# EAGLE design xmas-tree (EAGLE 6.5.0)
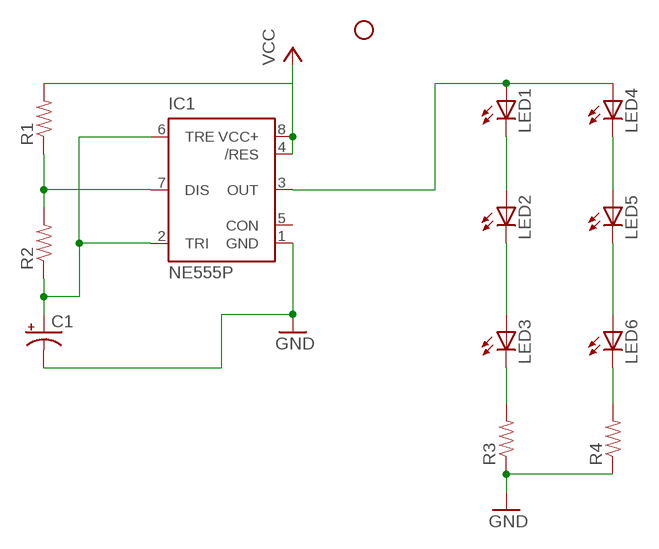
[diagram p0: schematic, sheet 1]

## Parts
C1  CAP_POLPTH2  [CPOL-RADIAL-10UF-25V]
IC1  NE555P  [DIL-08]
LED1  LED5MM  [LED5MM]
LED2  LED5MM  [LED5MM]
LED3  LED5MM  [LED5MM]
LED4  LED5MM  [LED5MM]
LED5  LED5MM  [LED5MM]
LED6  LED5MM  [LED5MM]
R1  RESISTORAXIAL-0.3  [AXIAL-0.3]
R2  RESISTORAXIAL-0.3  [AXIAL-0.3]
R3  RESISTORAXIAL-0.3  [AXIAL-0.3]
R4  RESISTORAXIAL-0.3  [AXIAL-0.3]
STANDOFF1  STAND-OFF  [STAND-OFF]

## Nets
GND: C1.2(-) IC1.1(GND) R3.P$1 R4.P$1
N$1: C1.1(+) IC1.2(TRI) IC1.6(TRE) R2.P$1
N$2: IC1.3(OUT) LED1.A LED4.A
N$3: LED1.K(C) LED2.A
N$4: LED2.K(C) LED3.A
N$5: LED3.K(C) R3.P$2
N$6: LED4.K(C) LED5.A
N$7: LED5.K(C) LED6.A
N$8: LED6.K(C) R4.P$2
N$9: IC1.7(DIS) R1.P$1 R2.P$2
VCC: IC1.4(/RES) IC1.8(VCC+) R1.P$2
Unconnected: IC1.5(CON)

## Library data of the parts
C1 = SparkFun-Passives:CAP_POL: Capacitor Polarized These are standard SMD and PTH capacitors. Normally 10uF, 47uF, and 100uF in electrolytic and tantalum varieties. Always verify the external diameter of the through hole cap, it varies with capacity, voltage, and manufacturer. The EIA devices should be standard.
IC1 = SparkFun-AnalogIC:NE555: General purpose bipolar Timer; MF: Arrow Electronics; MPN: NE555N; OC_FARNELL: 1467742; OC_NEWARK: 89K1486
LED1-LED6 = SparkFun-LED:LED: LEDs Standard schematic elements and footprints for 5mm, 3mm, 1206, and 0603 sized LEDs. 5mm - Spark Fun Electronics SKU : COM-00529 (and others)
R1-R4 = SparkFun-Passives:RESISTOR: Resistor Basic schematic elements and footprints for 0603, 1206, and PTH resistors.
STANDOFF1 = SparkFun-Electromechanical:STAND-OFF: #4 Stand Off This is the mechanical footprint for a #4 phillips button head screw. Use the keepout ring to avoid running the screw head into surrounding components. SKU : PRT-00447

## Board
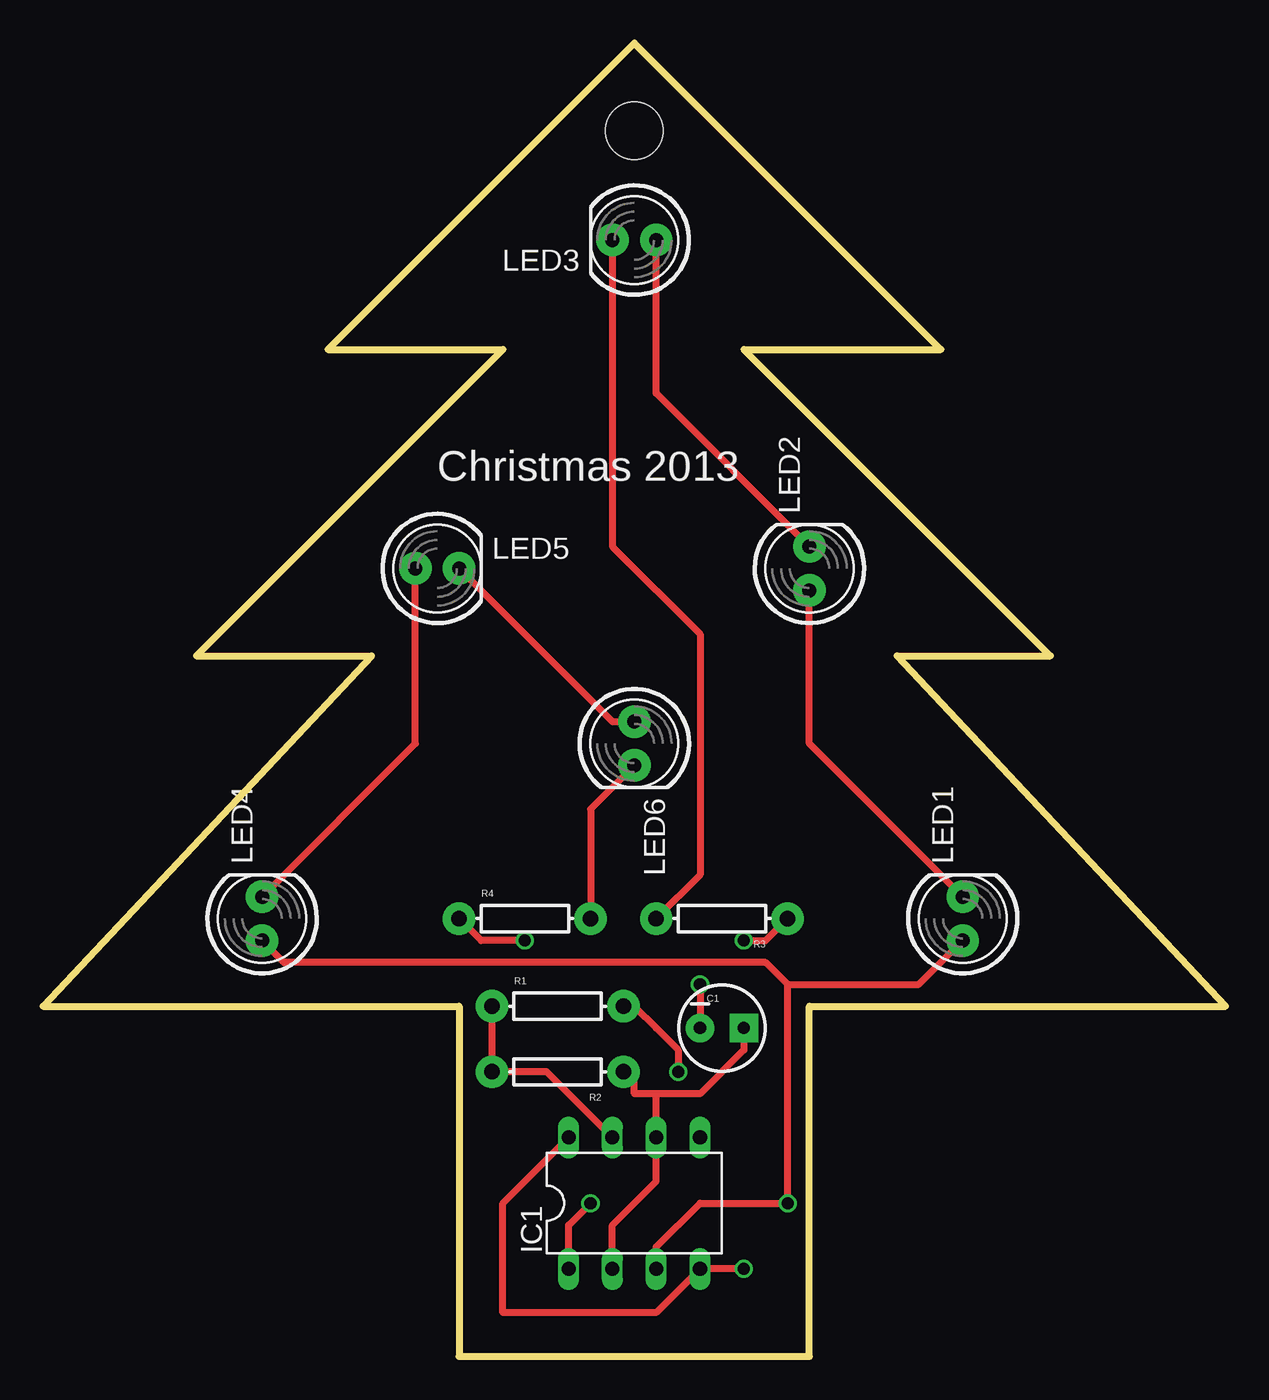
[diagram p1: board, top side]
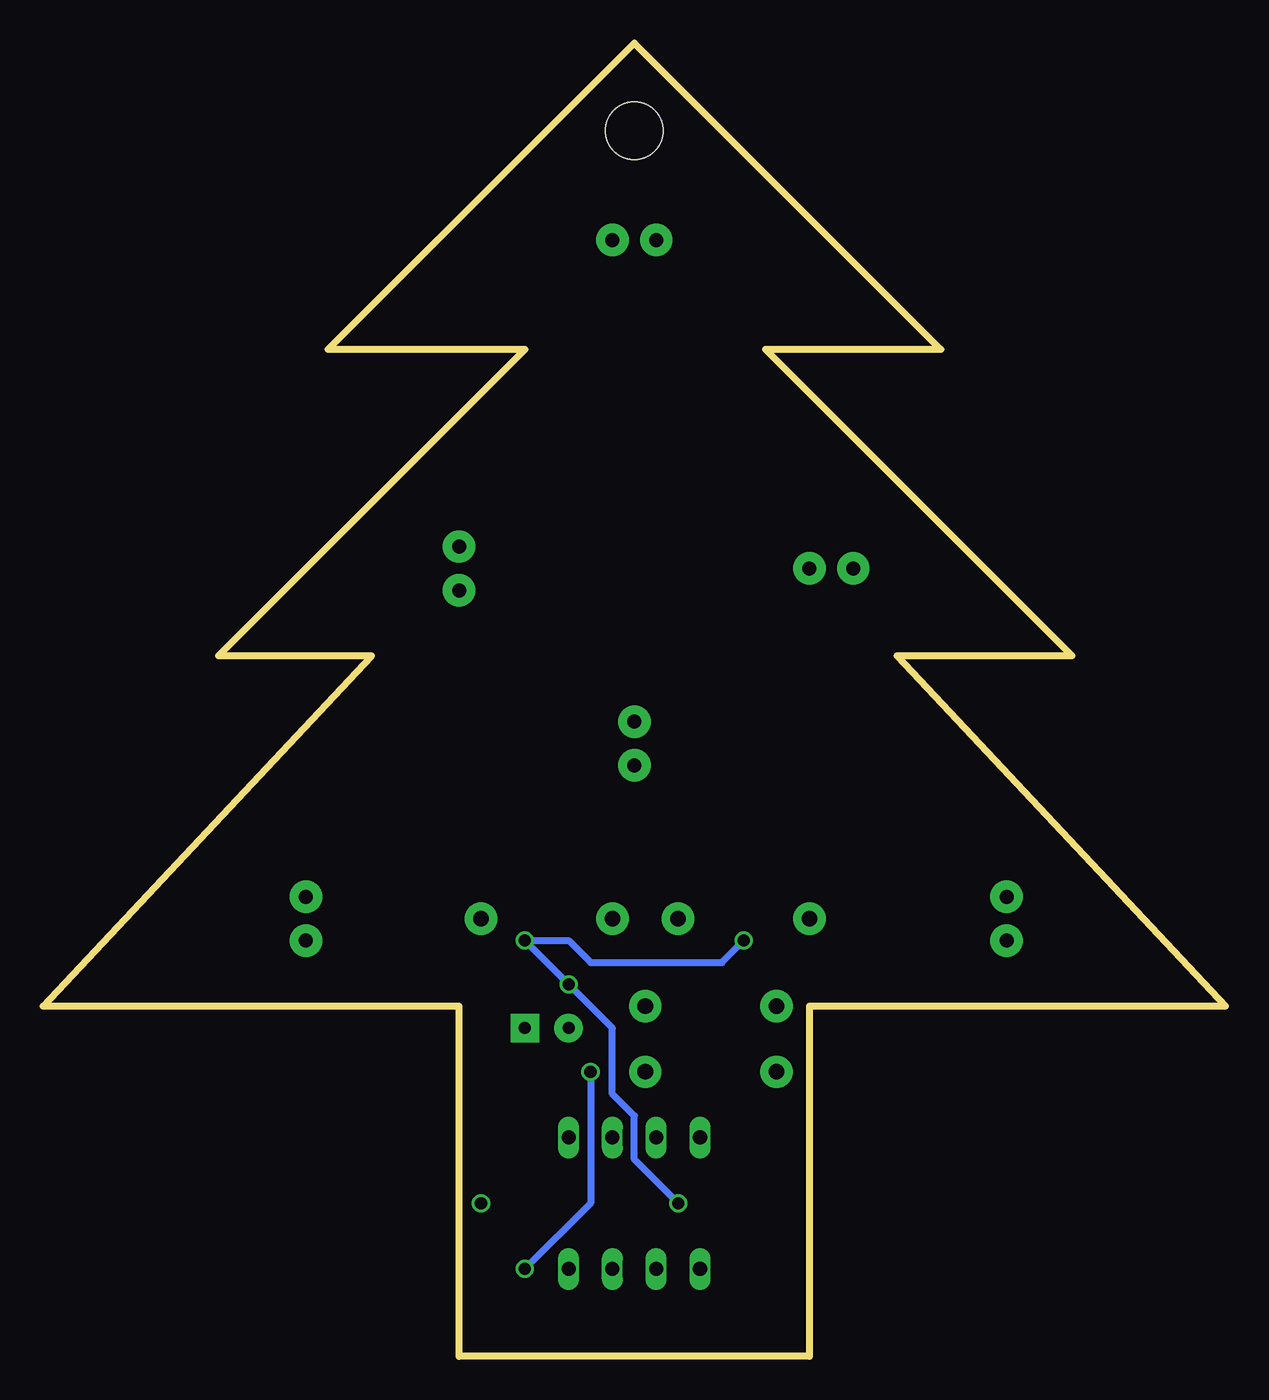
[diagram p2: board, bottom side, seen from below]

Size 68.58 x 76.2 mm. Coordinates in mm from the lower left corner, seen from the top.
Outline: 34.29,76.2 16.51,58.42 26.67,58.42 8.89,40.64 19.05,40.64 0,20.32 24.13,20.32 24.13,0 44.45,0 44.45,20.32 68.58,20.32 49.53,40.64 58.42,40.64 40.64,58.42 52.07,58.42 34.29,76.2
Copper layers (1*2*15*16): Top 0.035mm / dielectric 0.2mm / Route2 0.0175mm / dielectric 1.1mm / Route15 0.0175mm / dielectric 0.2mm / Bottom 0.035mm
Design rules "SeeedStudio_DRU_no_angle_20130527": minimum track width 6mil, minimum drill 12mil, track to track 6mil, track to pad 6mil, pad to pad 6mil, via to via 6mil, smd to smd 0mil, copper to edge 10mil, drill to drill 10mil, minimum pad ring 6mil, minimum via ring 6mil, stop-mask expansion 2mil, vias tented up to drill 25mil, thermal gap 10mil

### Footprints (pad centres in the part's own frame; a part is rotated, then mirrored left to right if it is on the bottom)
CPOL-RADIAL-10UF-25V = drill 0.7 pad 1.651 square: 1 1.27,0 | drill 0.7 pad 1.651: 2 -1.27,0
DIL-08 = drill 0.813 long: 1 -3.81,-3.81; 2 -1.27,-3.81; 3 1.27,-3.81; 4 3.81,-3.81; 5 3.81,3.81; 6 1.27,3.81; 7 -1.27,3.81; 8 -3.81,3.81
LED5MM = drill 0.813 pad 1.88: A -1.27,0; K 1.27,0
AXIAL-0.3 = drill 0.9 pad 1.88: P$1 -3.81,0; P$2 3.81,0
STAND-OFF = hole 3.302: 0,0

### Placement (x,y rotation side)
C1  39.37,19.05 0 top
IC1  34.29,8.89 0 top
LED1  53.34,25.4 90 top
LED2  44.45,45.72 90 top
LED3  34.29,64.77 180 top
LED4  12.7,25.4 90 top
LED5  22.86,45.72 0 top
LED6  34.29,35.56 270 top
R1  29.84,20.32 0 top
R2  29.84,16.51 180 top
R3  39.37,25.4 180 top
R4  27.94,25.4 0 top
STANDOFF1  34.29,71.12 0 top

### Tracks (layer width: path | path; a pad name or v marks a point on that pad's centre or on a via)
GND  (via drill 0.7)
  Top 0.406: IC1.1 30.48,7.62 v31.75,8.89 | v38.1,21.59 C1.2 | v27.94,24.13 25.4,24.13 R4.P$1 | v40.64,24.13 41.91,24.13 R3.P$1
  Bottom 0.406: v31.75,8.89 34.29,11.43 34.29,13.97 35.56,15.24 35.56,19.05 v38.1,21.59 v40.64,24.13 38.1,24.13 36.83,22.86 29.21,22.86 v27.94,24.13
N$1
  Top 0.406: IC1.2 33.02,7.62 35.56,10.16 IC1.6 35.56,15.24 | 35.56,15.24 34.29,15.24 34.29,16.51 R2.P$1 | C1.1 40.64,17.78 38.1,15.24 35.56,15.24
N$2  (via drill 0.7)
  Top 0.406: IC1.3 35.56,6.35 38.1,8.89 v43.18,8.89 43.18,21.59 | 43.18,21.59 50.8,21.59 LED1.A | 43.18,21.59 41.91,22.86 13.97,22.86 LED4.A
N$3
  Top 0.406: LED1.K 44.45,35.56 LED2.A
N$4
  Top 0.406: LED2.K 35.56,55.88 LED3.A
N$5
  Top 0.406: LED3.K 33.02,46.99 38.1,41.91 38.1,27.94 R3.P$2
N$6
  Top 0.406: LED4.K 21.59,35.56 LED5.A
N$7
  Top 0.406: LED5.K 33.02,36.83 LED6.A
N$8
  Top 0.406: LED6.K 31.75,31.75 R4.P$2
N$9
  Top 0.406: R1.P$1 R2.P$2 29.21,16.51 IC1.7
VCC  (via drill 0.7)
  Top 0.406: IC1.8 26.67,8.89 26.67,2.54 35.56,2.54 IC1.4 v40.64,5.08 | R1.P$2 34.29,20.32 35.56,19.05 36.83,17.78 v36.83,16.51
  Bottom 0.406: v36.83,16.51 36.83,8.89 v40.64,5.08

### Text on the board
tPlace: Christmas 2013